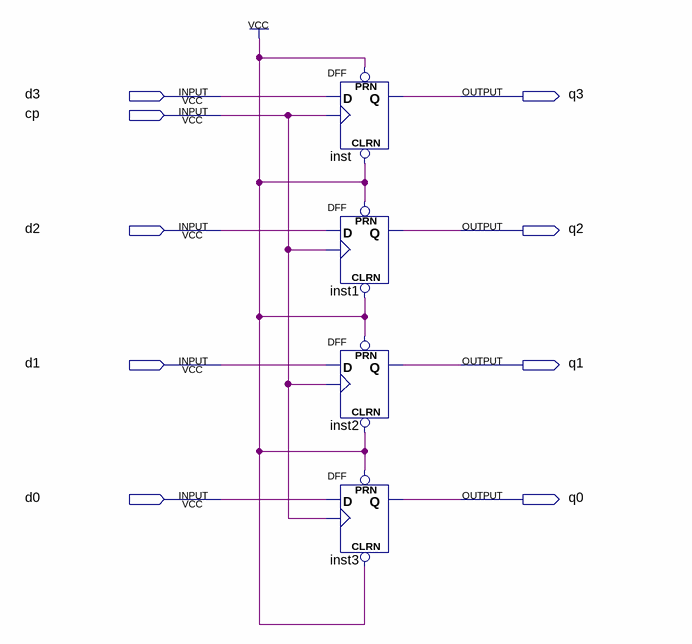
[diagram p0: schematic sheet]
// Quartus schematic TheOne.bdf as structural Verilog: 4 symbols, 9 pins
module TheOne (
  input  d3,
  input  cp,
  input  d2,
  input  d1,
  input  d0,
  output q3,
  output q2,
  output q1,
  output q0
);

  DFF inst (.CLRN(1'b1), .CLK(cp), .D(d3), .PRN(1'b1), .Q(q3));
  DFF inst1 (.CLRN(1'b1), .CLK(cp), .D(d2), .PRN(1'b1), .Q(q2));
  DFF inst2 (.CLRN(1'b1), .CLK(cp), .D(d1), .PRN(1'b1), .Q(q1));
  DFF inst3 (.CLRN(1'b1), .CLK(cp), .D(d0), .PRN(1'b1), .Q(q0));
endmodule
